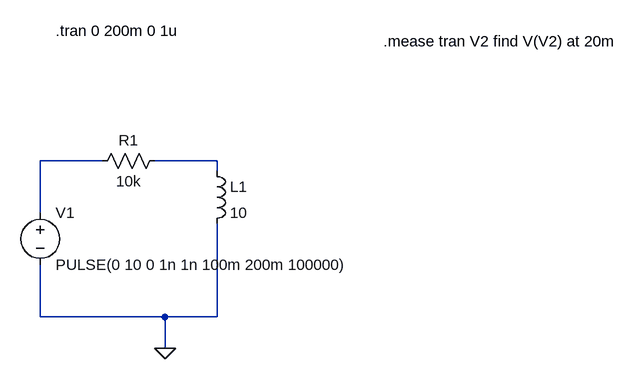
[diagram p0: schematic Question 2.asc]
Question 2.asc, the LTspice schematic file:
Version 4
SHEET 1 964 680
WIRE 144 240 48 240
WIRE 320 240 224 240
WIRE 320 256 320 240
WIRE 48 320 48 240
WIRE 48 480 48 400
WIRE 240 480 48 480
WIRE 320 480 320 336
WIRE 320 480 240 480
WIRE 240 528 240 480
FLAG 240 528 0
SYMBOL voltage 48 304 R0
WINDOW 123 0 0 Left 0
WINDOW 39 0 0 Left 0
SYMATTR InstName V1
SYMATTR Value PULSE(0 10 0 1n 1n 100m 200m 100000)
SYMBOL ind 304 240 R0
SYMATTR InstName L1
SYMATTR Value 10
SYMBOL res 240 224 R90
WINDOW 0 0 56 VBottom 2
WINDOW 3 32 56 VTop 2
SYMATTR InstName R1
SYMATTR Value 10k
TEXT 72 40 Left 2 !.tran 0 200m 0 1u
TEXT 576 56 Left 2 !.mease tran V2 find V(V2) at 20m

The netlist it stands for:
* Question 2.asc
V1 N001 0 PULSE(0 10 0 1n 1n 100m 200m 100000)
L1 N002 0 10
R1 N002 N001 10k
.tran 0 200m 0 1u
.mease tran V2 find V(V2) at 20m
.backanno
.end